# EAGLE design BDxxGC0WEFJ_Lineer_regulator (EAGLE 9.2.1)
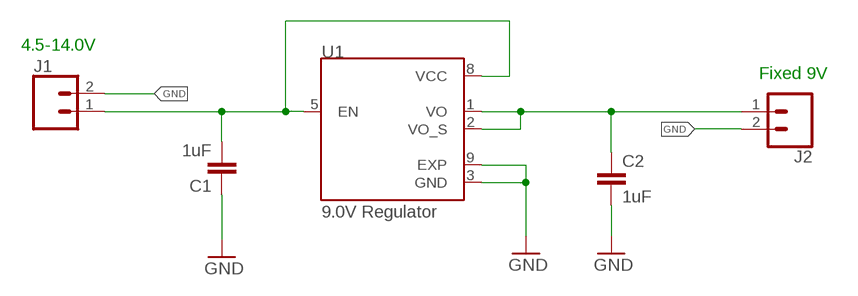
[diagram p0: schematic, sheet 1]

## Parts
C1  1uF  C-EUC0603  [C0603]
C2  1uF  C-EUC0603  [C0603]
J1  CONN_02  [1X02]
J2  CONN_02  [1X02]
U1  9.0V Regulator  BD50GC0WEFJ-E2  [SOIC127P600X100-9N]

## Nets
GND: C1.1 C2.2 J1.2 J2.2 U1.3(GND) U1.9(EXP)
N$1: C1.2 J1.1 U1.5(EN) U1.8(VCC)
N$2: C2.1 J2.1 U1.1(VO) U1.2(VO_S)

## Notes on the sheet
- 4.5-14.0V
- Fixed 9V

## Library data of the parts
C1 C2 = rcl:C-EU: CAPACITOR, European symbol; SPICEPREFIX: C
J1 J2 = SparkFun-Connectors:CONN_02: Multi connection point. Often used as Generic Header-pin footprint for 0.1 inch spaced/style header connections On any of the 0.1 inch spaced packages, you can populate with these: Break Away Headers - Straight <https://www.sparkfun.com/products/116> (PRT-00116) Break Away Male Headers - Right Angle <https://www.sparkfun.com/products/553> (PRT-00553) Female Headers <https://www.sparkfun.com/products/115> (PRT-00115) Break Away Headers - Machine Pin <https://www.sparkfun.com/products/117> (PRT-00117) Break Away Female Headers - Swiss Machine Pin <https://www.sparkfun.com/products/743> (PRT-00743) For SCREWTERMINALS and SPRING TERMINALS visit here: Screw Terimnals on SparkFun.com <https://www.sparkfun.com/search/results?term=Screw+Terminals> (5mm/3.5mm/2.54mm spacing) This device is also useful as a general connection point to wire up your design to another part of your project. Our various solder wires solder well into these plated through hole pads. Hook-Up Wire - Assortment (Stranded, 22 AWG) <https://www.sparkfun.com/products/11375> (PRT-11375) Hook-Up Wire - Assortment (Solid Core, 22 AWG) <https://www.sparkfun.com/products/11367> (PRT-11367) View the entire wire category on our website here <https://www.sparkfun.com/categories/141> Special notes: Molex polarized connector foot print use with: PRT-08233 with associated crimp pins and housings. 2.54_SCREWTERM for use with PRT-10571. 3.5mm Screw Terminal footprints for PRT-08084 5mm Screw Terminal footprints for use with PRT-08432
U1 = BD50GC0WEFJ-E2:BD50GC0WEFJ-E2: LDO Regulator Pos 5V 1A 8-Pin HTSOP-J EP T/R; AVAILABILITY: Unavailable; DESCRIPTION: LDO Regulator Pos 5V 1A 8-Pin HTSOP-J EP T/R; MF: Rohm; MP: BD50GC0WEFJ-E2; PACKAGE: SOIC-8 Rohm; PRICE: None

## Board
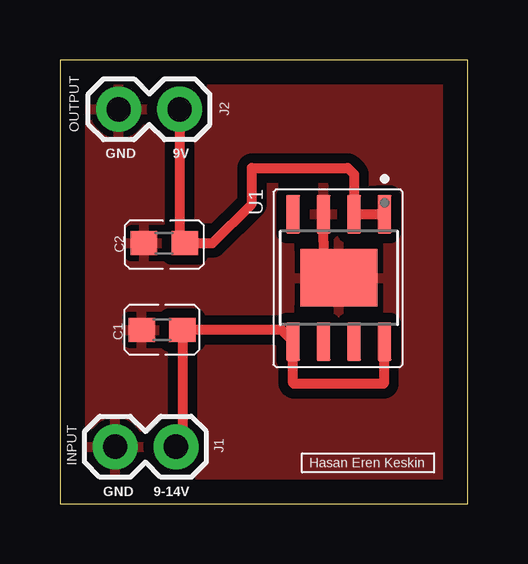
[diagram p1: board, top side]

Size 17 x 18.5 mm. Coordinates in mm from the lower left corner, seen from the top.
Outline: 0,0 17,0 17,18.5 0,18.5 0,0
Copper layers (1*16): Top 0.035mm / dielectric 1.5mm / Bottom 0.035mm
Design rules "default": minimum track width 6mil, minimum drill 0.35mm, track to track 6mil, track to pad 6mil, pad to pad 6mil, via to via 6mil, smd to smd 6mil, copper to edge 40mil, drill to drill 6mil, minimum pad ring 10mil, minimum via ring 8mil, stop-mask expansion 4mil, vias tented up to drill 0mil, thermal gap 10mil

### Footprints (pad centres in the part's own frame; a part is rotated, then mirrored left to right if it is on the bottom)
C0603 = smd 1.1 x 1: 1 -0.85,0; 2 0.85,0
1X02 = drill 1.016 pad 1.88: 1 0,0; 2 2.54,0
SOIC127P600X100-9N = smd 1.61 x 0.58: 1 -2.655,1.905; 2 -2.655,0.635; 3 -2.655,-0.635; 4 -2.655,-1.905; 5 2.655,-1.905; 6 2.655,-0.635; 7 2.655,0.635; 8 2.655,1.905 | smd 2.4 x 3.2: 9 0,0

### Placement (x,y rotation side)
C1  4.26,7.24 0 top
C2  4.35,10.86 180 top
J1  4.84,2.37 180 top
J2  4.99,16.44 180 top
U1  11.63,9.41 270 top

### Tracks (layer width: path | path; a pad name or v marks a point on that pad's centre or on a via)
GND
  Top 0.406: U1.3 11,9.8 U1.9
  pour Top (isolate 0.406): 0,18.6 17,18.6 17,0 16.8,-0.2 -0.8,-0.2 -0.8,17.8
N$1
  Top 0.406: U1.8 13.5,6.72 13.5,5 9.75,5 9.72,5.03 U1.5 9.24,7.24 C1.2 5.11,2.64 J1.1
N$2
  Top 0.406: J2.1 4.99,11.07 C2.1 6.36,10.86 8,12.5 8,14 12,14 12.27,13.73 U1.2 U1.1

### Text on the board
tNames: OUTPUT | GND | 9V | INPUT | Hasan Eren Keskin | GND | 9-14V